# Altium schematic sheet Harness_Wrapper.SchDoc
size A4; CompanyName: Technische Hochschule Nürnberg Georg Simon Ohm; Organization: UltraZohm; Address1: Kesslerplatz 12; Address2: 90489 Nürnberg; Address3: GERMANY; Website: www.ultrazohm.com
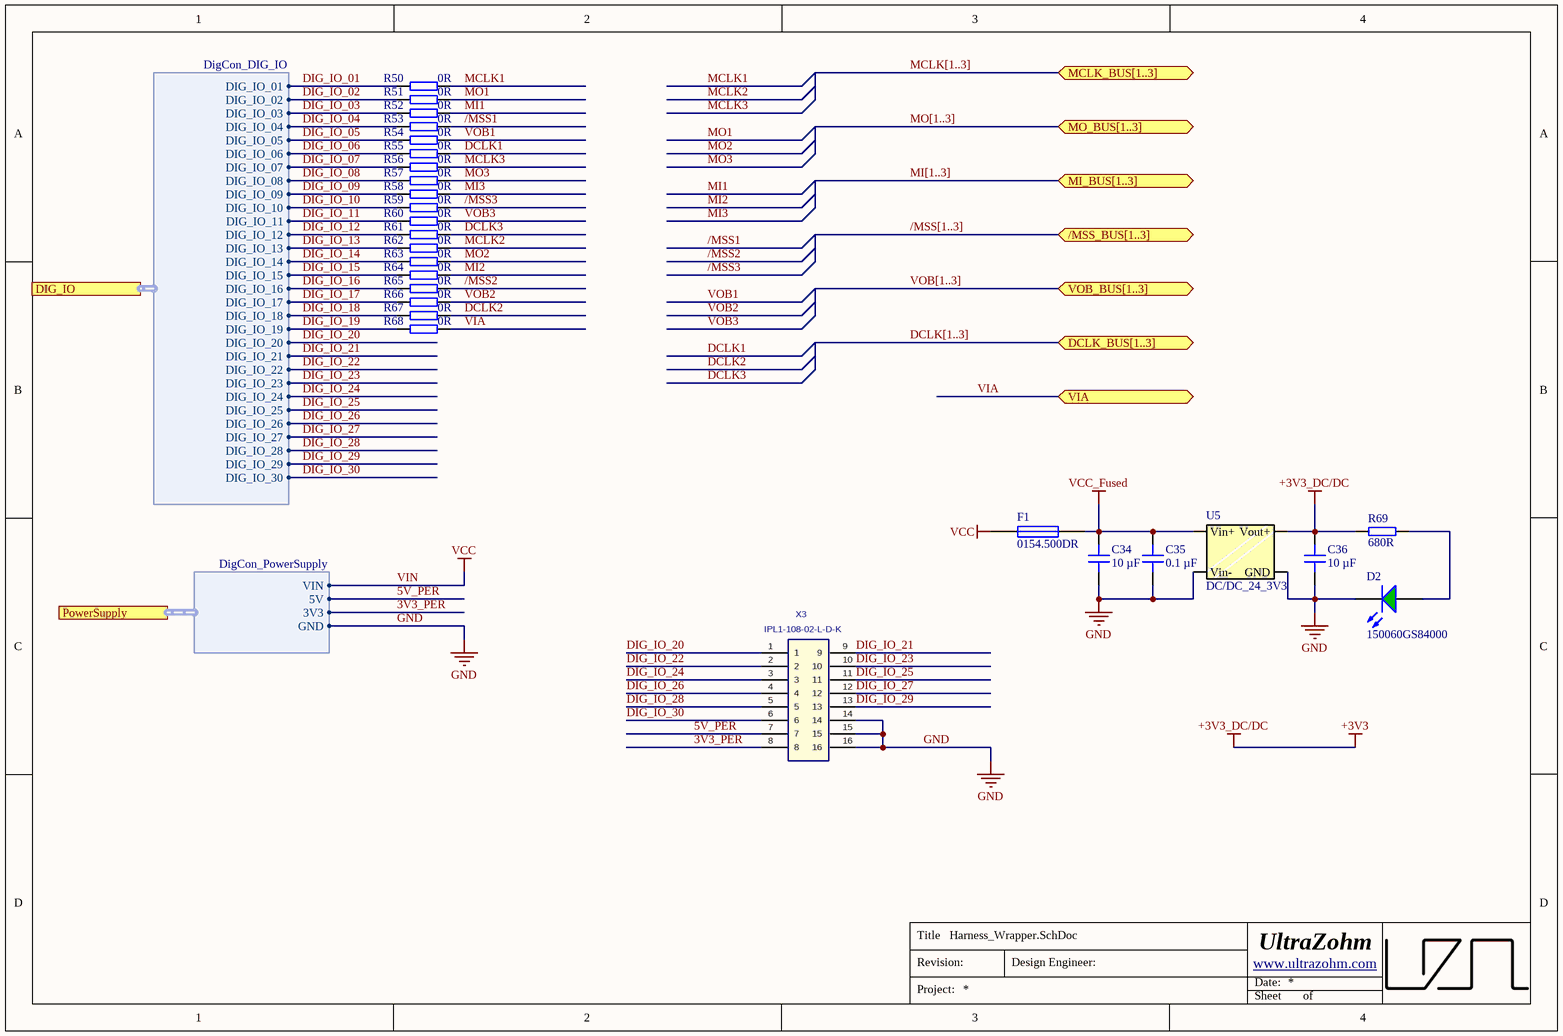
[diagram p0: Harness_Wrapper.SchDoc]

## Parts
C34  10 µF  [C_0603]
C35  0.1 µF  [C_0603]
C36  10 µF  [C_0603]
D2  150060GS84000  [WL-SMCW_0603]
F1  0154.500DR  [Littlefuse_154]
R50  0R  [RES 0603_1608]
R51  0R  [RES 0603_1608]
R52  0R  [RES 0603_1608]
R53  0R  [RES 0603_1608]
R54  0R  [RES 0603_1608]
R55  0R  [RES 0603_1608]
R56  0R  [RES 0603_1608]
R57  0R  [RES 0603_1608]
R58  0R  [RES 0603_1608]
R59  0R  [RES 0603_1608]
R60  0R  [RES 0603_1608]
R61  0R  [RES 0603_1608]
R62  0R  [RES 0603_1608]
R63  0R  [RES 0603_1608]
R64  0R  [RES 0603_1608]
R65  0R  [RES 0603_1608]
R66  0R  [RES 0603_1608]
R67  0R  [RES 0603_1608]
R68  0R  [RES 0603_1608]
R69  680R  [RES 0603_1608]
U5  DC/DC_24_3V3  [SIP4DCDC]
X3  IPL1-108-02-L-D-K  [IPL1-108-02-L-D-K]

## Ports
/MSS_BUS[1..3] (bidir), DCLK_BUS[1..3] (bidir), DIG_IO (harness DigCon_DIG_IO), MCLK_BUS[1..3] (bidir), MI_BUS[1..3] (bidir), MO_BUS[1..3] (bidir), PowerSupply (harness DigCon_PowerSupply), VIA (bidir), VOB_BUS[1..3] (bidir)

## Harnesses
DigCon_DIG_IO: DIG_IO_01, DIG_IO_02, DIG_IO_03, DIG_IO_04, DIG_IO_05, DIG_IO_06, DIG_IO_07, DIG_IO_08, DIG_IO_09, DIG_IO_10, DIG_IO_11, DIG_IO_12, DIG_IO_13, DIG_IO_14, DIG_IO_15, DIG_IO_16, DIG_IO_17, DIG_IO_18, DIG_IO_19, DIG_IO_20, DIG_IO_21, DIG_IO_22, DIG_IO_23, DIG_IO_24, DIG_IO_25, DIG_IO_26, DIG_IO_27, DIG_IO_28, DIG_IO_29, DIG_IO_30
DigCon_PowerSupply: GND, 3V3, 5V, VIN

## Nets
+3V3: C36.2 R69.1 U5.6(Vout+)  [also labelled +3V3_DC/DC]
GND: C34.1 C35.1 C36.1 D2.1(K) U5.2(Vin-) U5.4(GND) X3.14 X3.15 X3.16 ; port PowerSupply.GND
VCC_Fused: C34.2 C35.2 F1.2 U5.1(Vin+)
VIN: F1.1 ; port PowerSupply.VIN  [also labelled VCC]
3V3_PER: X3.8 ; port PowerSupply.3V3
5V_PER: X3.7 ; port PowerSupply.5V
/MSS1: R53.2
/MSS2: R65.2
/MSS3: R59.2
DCLK1: R55.2
DCLK2: R67.2
DCLK3: R61.2
DIG_IO_01: R50.1 ; port DIG_IO.DIG_IO_01
DIG_IO_02: R51.1 ; port DIG_IO.DIG_IO_02
DIG_IO_03: R52.1 ; port DIG_IO.DIG_IO_03
DIG_IO_04: R53.1 ; port DIG_IO.DIG_IO_04
DIG_IO_05: R54.1 ; port DIG_IO.DIG_IO_05
DIG_IO_06: R55.1 ; port DIG_IO.DIG_IO_06
DIG_IO_07: R56.1 ; port DIG_IO.DIG_IO_07
DIG_IO_08: R57.1 ; port DIG_IO.DIG_IO_08
DIG_IO_09: R58.1 ; port DIG_IO.DIG_IO_09
DIG_IO_10: R59.1 ; port DIG_IO.DIG_IO_10
DIG_IO_11: R60.1 ; port DIG_IO.DIG_IO_11
DIG_IO_12: R61.1 ; port DIG_IO.DIG_IO_12
DIG_IO_13: R62.1 ; port DIG_IO.DIG_IO_13
DIG_IO_14: R63.1 ; port DIG_IO.DIG_IO_14
DIG_IO_15: R64.1 ; port DIG_IO.DIG_IO_15
DIG_IO_16: R65.1 ; port DIG_IO.DIG_IO_16
DIG_IO_17: R66.1 ; port DIG_IO.DIG_IO_17
DIG_IO_18: R67.1 ; port DIG_IO.DIG_IO_18
DIG_IO_19: R68.1 ; port DIG_IO.DIG_IO_19
DIG_IO_20: X3.1 ; port DIG_IO.DIG_IO_20
DIG_IO_21: X3.9 ; port DIG_IO.DIG_IO_21
DIG_IO_22: X3.2 ; port DIG_IO.DIG_IO_22
DIG_IO_23: X3.10 ; port DIG_IO.DIG_IO_23
DIG_IO_24: X3.3 ; port DIG_IO.DIG_IO_24
DIG_IO_25: X3.11 ; port DIG_IO.DIG_IO_25
DIG_IO_26: X3.4 ; port DIG_IO.DIG_IO_26
DIG_IO_27: X3.12 ; port DIG_IO.DIG_IO_27
DIG_IO_28: X3.5 ; port DIG_IO.DIG_IO_28
DIG_IO_29: X3.13 ; port DIG_IO.DIG_IO_29
DIG_IO_30: X3.6 ; port DIG_IO.DIG_IO_30
MCLK1: R50.2
MCLK2: R62.2
MCLK3: R56.2
MI1: R52.2
MI2: R64.2
MI3: R58.2
MO1: R51.2
MO2: R63.2
MO3: R57.2
VIA: R68.2 ; port VIA
VOB1: R54.2
VOB2: R66.2
VOB3: R60.2
NetD2_2: D2.2(A) R69.2

## Buses and harness runs
bus /MSS[1..3] = port /MSS_BUS[1..3]
bus DCLK[1..3] = port DCLK_BUS[1..3]
bus MCLK[1..3] = port MCLK_BUS[1..3]
bus MI[1..3] = port MI_BUS[1..3]
bus MO[1..3] = port MO_BUS[1..3]
bus VOB[1..3] = port VOB_BUS[1..3]

## Notes on the sheet
- Title
- Revision:
- Design Engineer:
- Date:
- Project:
- Sheet
- of

## Library data of the parts
C34 C36 = GRM185R60J106ME15D: Capacitor 0603, 6.3 VDC, 10 µF, X5R; Manufacturer: muRata; Tolerance: 20 %; Voltage Rating: 6.3 VDC; Created from: MGremer; Manufacturer Part Number: GRM185R60J106ME15D; PartID: 10; Created On: 20.12.2020 13:54:13; ComponentLink1Description: Datasheet; ComponentLink1URL: https://www.mouser.de/datasheet/2/281/murata_03052018_GRM_Series_1-1310166.pdf; Component Type: Capacitor 0603; Device Package: 0603; Last Updated: 27.05.2022 14:13:40; Mounting Type: SMD; Operating Temperature: -55 - 85°C; Series: GRM; Supplier 1: Mouser; Supplier Part Number 1: 81-GRM185R60J106ME5D; Type: Capacitor; Value: 10 µF; Live Cycle Status: 1; Stock number: Labor SMD Container; LCSC Part Number: C19702
C35 = C0603X104K5RAC7411: Capacitor 0603, 50 VDC, 0.1 µF, X7R; Manufacturer: KEMET; Tolerance: 10 %; Voltage Rating: 50 VDC; Created from: MGremer; Manufacturer Part Number: C0603X104K5RAC7411; PartID: 3; Created On: 20.12.2020 13:54:13; ComponentLink1Description: Datasheet; ComponentLink1URL: https://www.mouser.de/datasheet/2/212/1/KEM_C1013_X7R_FT_CAP_SMD-1103280.pdf; Component Type: Capacitor 0603; Device Package: 0603; Last Updated: 04.03.2021 09:24:28; Mounting Type: SMD; Operating Temperature: -55 - 125°C; Series: SMD Comm X7R Flex; Supplier 1: Mouser; Supplier Part Number 1: 80-C0603X104K5R7411; Type: Capacitor; Value: 0.1 µF; Live Cycle Status: 1; Stock number: Labor SMD Container; Supplier 2: LCSC; Supplier Part Number 2: C14663; LCSC Part Number: C14663
D2 = 150060GS84000: WL-SMCW SMD Mono-color Chip LED Waterclear Green; Manufacturer: Wuerth Elektronik; Type: Standard; Created from: MGremer; Forward Current I_f: 20 mA; Forward Voltage U_f: 3.2 V; Wavelength: 525 nm; Light Intensity: 3000 mcd; Nominal Power: 78 mW; Manufacturer Part Number: 150060GS84000; PartID: 2; Created On: 08.12.2020 10:41:11; ComponentLink1Description: Datasheet; ComponentLink1URL: https://www.mouser.de/datasheet/2/445/150060GS75020-1714345.pdf; Component Type: LED Diode; Device Package: 0603; Last Updated: 25.01.2024 19:29:32; Mounting Type: SMD; Operating Temperature: -40 - 85 °C; Supplier 1: Mouser; Supplier Part Number 1: 710-150060GS84000; Supplier 2: Farnell; Supplier Part Number 2: 3408612; Supplier 3: Digi-Key; Supplier Part Number 3: 732-150060GS84000CT-ND; Live Cycle Status: 1; Stock number: not stored; Color: green; LCSC Part Number: C72043
F1 = 0154.500DR: Fuse OMNI BLOK 154; Manufacturer: Littlefuse; Nominal current: 500 mA; Nominal voltage AC: 125 VAC; Nominal voltage DC: 125 VDC; Resistance: 304.6 mOhm; Value: 500 mA; Created from: MGremer; Manufacturer Part Number: 0154.500DR; PartID: 2; Created On: 07.01.2021 10:17:19; ComponentLink1Description: Datasheet; ComponentLink1URL: https://www.mouser.de/datasheet/2/240/Littelfuse_Fuse_154_154T_154L_154TL_Datasheet_pdf-365375.pdf; Component Type: NAN02 - 154 OMNI-BLOK; Device Package: OMNI-BLOK; Last Updated: 25.01.2024 19:51:27; Mounting Type: SMD; Operating Temperature: -55 - 125 °C; Series: 154; Supplier 1: Mouser; Supplier Part Number 1: 576-0154.500DR; Type: Fuse; Live Cycle Status: 1; LCSC Part Number: C720204
R50-R68 = RC0603JR-070RL: SMD resistor E24 series; Manufacturer: YAGEO; Tolerance: 5%; Created from: MGremer; Manufacturer Part Number: RC0603JR-070RL; PartID: 1; Created On: 14.12.2020 16:17:14; ComponentLink1Description: Datasheet; ComponentLink1URL: https://www.mouser.de/datasheet/2/447/PYu-RC_Group_51_RoHS_L_10-1664068.pdf; Component Type: SMD resistor; Device Package: 0603; Last Updated: 04.03.2021 09:09:42; Mounting Type: SMD; Supplier 1: Mouser; Supplier Part Number 1: 603-RC0603JR-070RL; Supplier 2: LCSC; Supplier Part Number 2: C21189; Type: Resistor; Value: 0R; Live Cycle Status: 1; Stock number: Labor SMD Container; LCSC Part Number: C21189
R69 = RK73B1JTTDD681J: SMD resistor E24 series; Manufacturer: KOA Speer; Tolerance: 5%; Created from: MGremer; Manufacturer Part Number: RK73B1JTTDD681J; PartID: 70; Created On: 14.12.2020 16:17:14; ComponentLink1Description: Datasheet; ComponentLink1URL: https://www.mouser.de/datasheet/2/219/RK73B-1825463.pdf; Component Type: SMD resistor; Device Package: 0603; Last Updated: 27.05.2022 08:00:04; Mounting Type: SMD; Supplier 1: Mouser; Supplier Part Number 1: 660-RK73B1JTTDD681J; Type: Resistor; Value: 680R; Live Cycle Status: 1; Stock number: Labor SMD Container; Supplier 2: LCSC; Supplier Part Number 2: C23228; LCSC Part Number: C23228
U5 = DC/DC_Single: pin to pad: 1>2 2>1 4>3 6>4; LCSC Part Number: C7500913
X3 = IPL1-108-02-L-D-K: 2.54 mm Double Row Termin Assembly (SMD); Manufacturer: SAMTEC; Created from: MGremer; Number of positions: 8; Manufacturer Part Number: IPL1-108-02-L-D-K; PartID: 18; Created On: 30.11.2020 10:38:50; ComponentLink1Description: Homepage; ComponentLink1URL: https://www.samtec.com/products/ipl1; Component Type: Samtec Connector; Device Package: Connector; Last Updated: 01.04.2021 08:16:12; Mounting Type: SMD; Supplier 1: SAMTEC; Supplier Part Number 1: IPL1-108-02-L-D-K; Type: Connector; Live Cycle Status: 1; Number of rows: 2; Stock number: not stored; Supplier 2: Digi-Key; Supplier Part Number 2: SAM9606-ND